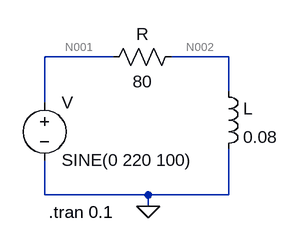
[diagram p0: schematic Draft1.asc]
Draft1.asc, the LTspice schematic file:
Version 4
SHEET 1 880 680
WIRE 144 80 48 80
WIRE 304 80 224 80
WIRE 304 128 304 80
WIRE 48 144 48 80
WIRE 48 272 48 224
WIRE 192 272 48 272
WIRE 304 272 304 208
WIRE 304 272 192 272
WIRE 192 288 192 272
FLAG 192 288 0
SYMBOL voltage 48 128 R0
WINDOW 123 0 0 Left 0
WINDOW 39 0 0 Left 0
SYMATTR InstName V
SYMATTR Value SINE(0 220 100)
SYMBOL res 128 96 R270
WINDOW 0 32 56 VTop 2
WINDOW 3 -3 56 VBottom 2
SYMATTR InstName R
SYMATTR Value 80
SYMBOL ind 288 112 R0
SYMATTR InstName L
SYMATTR Value 0.08
TEXT 54 296 Left 2 !.tran 0.1

The netlist it stands for:
* Draft1.asc
V N001 0 SINE(0 220 100)
R N001 N002 80
L N002 0 0.08
.tran 0.1
.backanno
.end

* Results of the author's LTspice run, read from the files saved beside the schematic
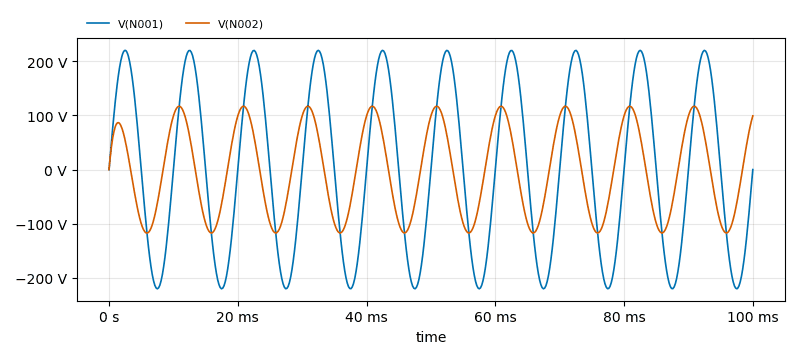
[diagram p1: Transient Analysis of Draft1.asc, plotted from the saved traces]
* Transient Analysis, 1 run:
*   V(N001): min -220 V, max 220 V, average 4.868 mV, rms 155.6 V, last 0 V
*   V(N002): min -117.2 V, max 117 V, average -990.5 mV, rms 81.81 V, last 99.12 V